# Altium schematic sheet LazeMWC.SchDoc
size A4
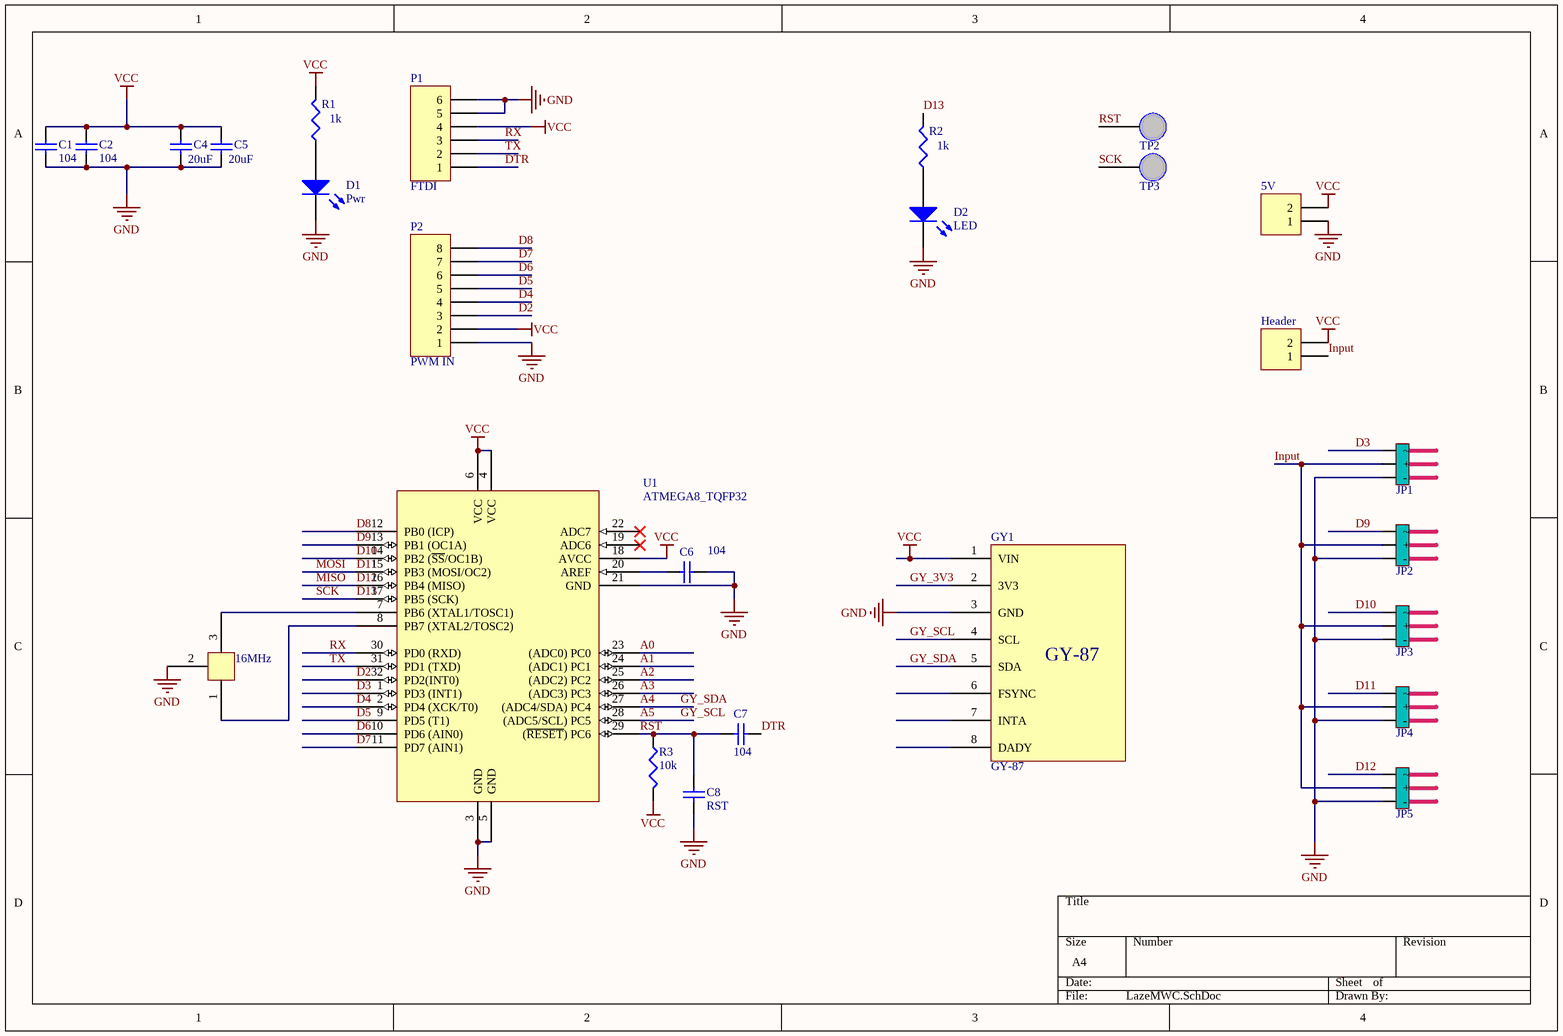
[diagram p0: LazeMWC.SchDoc]

## Parts
5V  Header 2  [HDR1X2]  (value not drawn)
C1  104  [CAPC1608L]
C2  104  [CAPC1608L]
C4  20uF  [CAPC3216L]
C5  20uF  [CAPC3216L]
C6  104  [CAPC1608L]
C7  104  [CAPC1608L]
C8  RST  [CAPC1608L]
Crystal1  16MHz  [Crystal3Foot]
D1  Pwr  [CAPC2012L]
D2  LED  [CAPC2012L]
GY1  GY-87  [GY-87]
Header  Header 2  [HDR1X2]  (value not drawn)
JP1  Servo out 1  [JP]  (value not drawn)
JP2  Servo out 1  [JP]  (value not drawn)
JP3  Servo out 1  [JP]  (value not drawn)
JP4  Servo out 1  [JP]  (value not drawn)
JP5  Servo out 1  [JP]  (value not drawn)
P1  FTDI  [HDR1X6]
P2  PWM IN  [HDR1X8]
R1  1k  [RESC1608L]
R2  1k  [RESC1608L]
R3  10k  [RESC1608L]
TP2  Test Pad  [Test Pad]  (value not drawn)
TP3  Test Pad  [Test Pad]  (value not drawn)
U1  ATMEGA8_TQFP32  [atmega328fix]

## Nets
GND: 5V.1 C1.1 C2.1 C4.1 C5.1 C6.2 C8.1 Crystal1.2 D1.2(K) D2.2(K) GY1.3(GND) JP1.3(-) JP2.3(-) JP3.3(-) JP4.3(-) JP5.3(-) P1.5 P1.6 P2.1 U1.3(GND) U1.5(GND) U1.21(GND)
VCC: 5V.2 C1.2 C2.2 C4.2 C5.2 GY1.1(VIN) Header.2 P1.4 P2.2 R1.2 R3.2 U1.4(VCC) U1.6(VCC) U1.18(AVCC)
A0: U1.23((ADC0)_PC0)
A1: U1.24((ADC1)_PC1)
A2: U1.25((ADC2)_PC2)
A3: U1.26((ADC3)_PC3)
A4: GY1.5(SDA) U1.27((ADC4/SDA)_PC4)  [also labelled GY_SDA]
A5: GY1.4(SCL) U1.28((ADC5/SCL)_PC5)  [also labelled GY_SCL]
D2: P2.3 U1.32(PD2(INT0))
D3: JP1.1 U1.1(PD3_(INT1))
D4: P2.4 U1.2(PD4_(XCK/T0))
D5: P2.5 U1.9(PD5_(T1))
D6: P2.6 U1.10(PD6_(AIN0))
D7: P2.7 U1.11(PD7_(AIN1))
D8: P2.8 U1.12(PB0_(ICP))
D9: JP2.1 U1.13(PB1_(OC1A))
D10: JP3.1 U1.14(PB2_(~{SS}/OC1B))
D11: JP4.1 U1.15(PB3_(MOSI/OC2))  [also labelled MOSI]
D12: JP5.1 U1.16(PB4_(MISO))  [also labelled MISO]
D13: R2.2 TP3.1 U1.17(PB5_(SCK))  [also labelled SCK]
DTR: C7.2 P1.1
GY_3V3: GY1.2(3V3)
Input: Header.1 JP1.2(+) JP2.2(+) JP3.2(+) JP4.2(+) JP5.2(+)
RST: C7.1 C8.2 R3.1 TP2.1 U1.29((~{RESET})_PC6)
RX: P1.3 U1.30(PD0_(RXD))
TX: P1.2 U1.31(PD1_(TXD))
NetC6_1: C6.1 U1.20(AREF)
NetCrystal1_1: Crystal1.1 U1.8(PB7_(XTAL2/TOSC2))
NetCrystal1_3: Crystal1.3 U1.7(PB6_(XTAL1/TOSC1))
NetD1_1: D1.1(A) R1.1
NetD2_1: D2.1(A) R2.1

Not connected (* = marked no-connect by the designer): GY1 6(FSYNC) 7(INTA) 8(DADY); U1 19(ADC6)* 22(ADC7)*

## Library data of the parts
5V Header = Header 2: Header, 2-Pin; LatestRevisionDate: 17-Jul-2002; LatestRevisionNote: Re-released for DXP Platform.; Publisher: Altium Limited
C1 C2 C6-C8 = Cap Semi: Capacitor (Semiconductor SIM Model); Value: 0.1uF; Published: 8-Jun-2000; LatestRevisionDate: 29-May-2009; LatestRevisionNote: IPC-7351 Footprint Added.; PackageReference: C1206; Publisher: Altium Limited; PackageDescription: Chip Capacitor
C4 C5 = Cap Semi: Capacitor (Semiconductor SIM Model); Published: 8-Jun-2000; LatestRevisionDate: 29-May-2009; LatestRevisionNote: IPC-7351 Footprint Added.; PackageReference: C1206; Publisher: Altium Limited; PackageDescription: Chip Capacitor; Value: 20uF
Crystal1 = Crystal3Foot
D1 D2 = LED2: Typical RED, GREEN, YELLOW, AMBER GaAs LED; Published: 8-Jun-2000; LatestRevisionDate: 17-Jul-2002; LatestRevisionNote: Re-released for DXP Platform.; PackageVersion: Feb-2002; PackageReference: 3.2X1.6X1.1; Publisher: Altium Limited
JP1-JP5 = Hdr 3 Pin 0.1: Header, 3-Pin, 0.1"; Manufacturer: Generic Components; Class: Connector; Supplier 1: Digi-Key; Supplier Part Number 1: MTLW-103-23-S-S-260-ND
P1 = Header 6: Header, 6-Pin; LatestRevisionDate: 17-Jul-2002; LatestRevisionNote: Re-released for DXP Platform.; Publisher: Altium Limited
P2 = Header 8: Header, 8-Pin; LatestRevisionDate: 17-Jul-2002; LatestRevisionNote: Re-released for DXP Platform.; Publisher: Altium Limited
R1 R2 = Res3: Resistor; Value: 4.7k; Published: 8-Jun-2000; LatestRevisionDate: 29-May-2009; LatestRevisionNote: IPC-7351 Footprint Added.; PackageReference: J1-0603; Publisher: Altium Limited; PackageDescription: Chip Resistor
R3 = Res3: Resistor; Published: 8-Jun-2000; LatestRevisionDate: 29-May-2009; LatestRevisionNote: IPC-7351 Footprint Added.; PackageReference: J1-0603; Publisher: Altium Limited; PackageDescription: Chip Resistor; Value: 10k
U1 = ATMEGA8_TQFP32: Atmel Microcontroller - Library created by carel..  <www.mpfreezone.com>